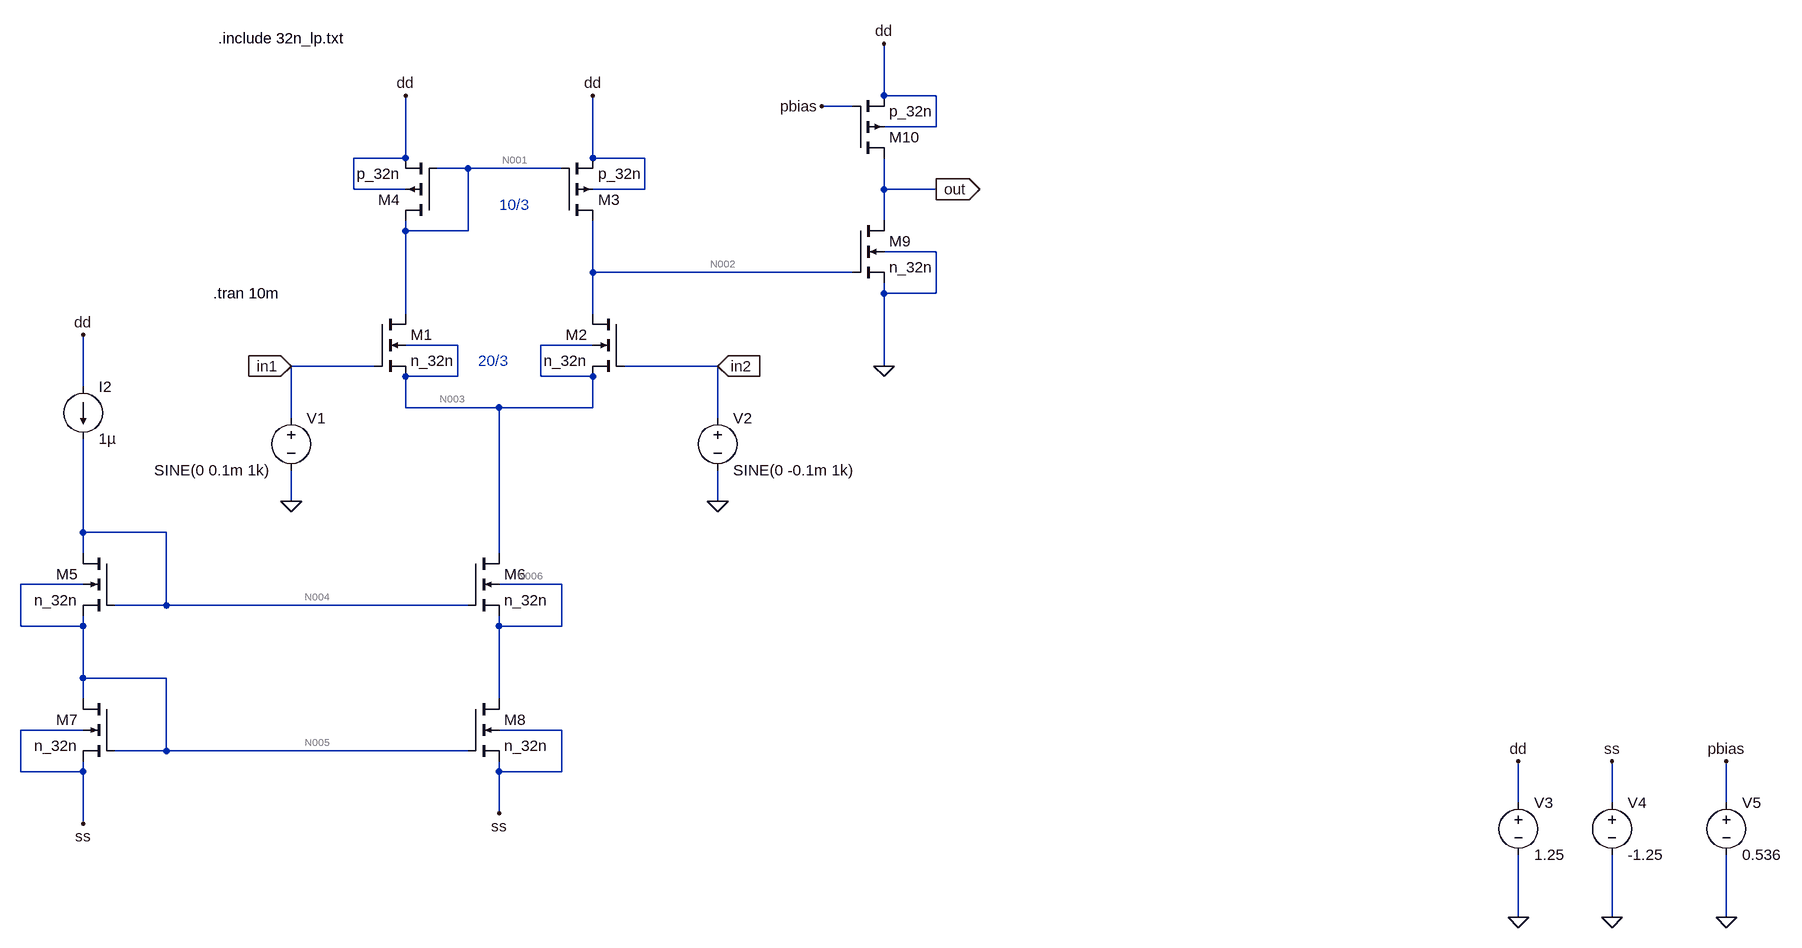
[diagram p0: schematic 32nm_ota.asc]
32nm_ota.asc, the LTspice schematic file:
Version 4
SHEET 1 3220 1188
WIRE 512 -96 512 -176
WIRE 592 -96 512 -96
WIRE 464 -80 416 -80
WIRE 592 -48 592 -96
WIRE 592 -48 512 -48
WIRE -224 0 -224 -96
WIRE -224 0 -304 0
WIRE 64 0 64 -96
WIRE 144 0 64 0
WIRE -128 16 -176 16
WIRE 16 16 -128 16
WIRE -304 48 -304 0
WIRE -224 48 -304 48
WIRE 144 48 144 0
WIRE 144 48 64 48
WIRE 512 48 512 0
WIRE 592 48 512 48
WIRE 512 96 512 48
WIRE -224 112 -224 96
WIRE -128 112 -128 16
WIRE -128 112 -224 112
WIRE 592 144 512 144
WIRE 64 176 64 96
WIRE 464 176 64 176
WIRE 512 208 512 192
WIRE 592 208 592 144
WIRE 592 208 512 208
WIRE -224 240 -224 112
WIRE 64 240 64 176
WIRE -144 288 -224 288
WIRE 64 288 -16 288
WIRE -272 320 -400 320
WIRE 256 320 112 320
WIRE 512 320 512 208
WIRE -144 336 -144 288
WIRE -144 336 -224 336
WIRE -16 336 -16 288
WIRE 64 336 -16 336
WIRE -720 352 -720 272
WIRE -224 384 -224 336
WIRE -80 384 -224 384
WIRE 64 384 64 336
WIRE 64 384 -80 384
WIRE -400 400 -400 320
WIRE 256 400 256 320
WIRE -400 528 -400 480
WIRE 256 528 256 480
WIRE -720 576 -720 432
WIRE -592 576 -720 576
WIRE -720 608 -720 576
WIRE -80 608 -80 384
WIRE -720 656 -816 656
WIRE 16 656 -80 656
WIRE -592 688 -592 576
WIRE -592 688 -672 688
WIRE -128 688 -592 688
WIRE -816 720 -816 656
WIRE -720 720 -720 704
WIRE -720 720 -816 720
WIRE -80 720 -80 704
WIRE 16 720 16 656
WIRE 16 720 -80 720
WIRE -720 800 -720 720
WIRE -592 800 -720 800
WIRE -720 832 -720 800
WIRE -80 832 -80 720
WIRE -720 880 -816 880
WIRE 16 880 -80 880
WIRE -592 912 -592 800
WIRE -592 912 -672 912
WIRE -128 912 -592 912
WIRE -816 944 -816 880
WIRE -720 944 -720 928
WIRE -720 944 -816 944
WIRE -80 944 -80 928
WIRE 16 944 16 880
WIRE 16 944 -80 944
WIRE 1488 992 1488 928
WIRE 1632 992 1632 928
WIRE 1808 992 1808 928
WIRE -80 1008 -80 944
WIRE -720 1024 -720 944
WIRE 1488 1168 1488 1072
WIRE 1632 1168 1632 1072
WIRE 1808 1168 1808 1072
FLAG 256 528 0
FLAG -400 528 0
FLAG 64 -96 dd
FLAG -224 -96 dd
FLAG 1488 1168 0
FLAG 1488 928 dd
FLAG 592 48 out
IOPIN 592 48 Out
FLAG -400 320 in1
IOPIN -400 320 In
FLAG 256 320 in2
IOPIN 256 320 In
FLAG -720 272 dd
FLAG 1632 1168 0
FLAG 1632 928 ss
FLAG -720 1024 ss
FLAG -80 1008 ss
FLAG 512 320 0
FLAG 512 -176 dd
FLAG 1808 1168 0
FLAG 1808 928 pbias
FLAG 416 -80 pbias
SYMBOL nmos4 -272 240 R0
SYMATTR InstName M1
SYMATTR Value n_32n
SYMATTR Value2 l=96n w=1.8u
SYMBOL nmos4 112 240 M0
SYMATTR InstName M2
SYMATTR Value n_32n
SYMATTR Value2 l=96n w=1.8u
SYMBOL voltage -400 384 R0
WINDOW 3 -211 96 Left 2
WINDOW 123 0 0 Left 0
WINDOW 39 0 0 Left 0
SYMATTR Value SINE(0 0.1m 1k)
SYMATTR InstName V1
SYMBOL voltage 256 384 R0
WINDOW 123 0 0 Left 0
WINDOW 39 0 0 Left 0
SYMATTR InstName V2
SYMATTR Value SINE(0 -0.1m 1k)
SYMBOL voltage 1488 976 R0
WINDOW 123 0 0 Left 0
WINDOW 39 0 0 Left 0
SYMATTR InstName V3
SYMATTR Value 1.25
SYMBOL pmos4 16 96 M180
SYMATTR InstName M3
SYMATTR Value p_32n
SYMATTR Value2 l=96n w=1u
SYMBOL pmos4 -176 96 R180
SYMATTR InstName M4
SYMATTR Value p_32n
SYMATTR Value2 l=96n w=1u
SYMBOL nmos4 -672 608 M0
SYMATTR InstName M5
SYMATTR Value n_32n
SYMATTR Value2 l=640n w=32n
SYMBOL nmos4 -128 608 R0
SYMATTR InstName M6
SYMATTR Value n_32n
SYMATTR Value2 l=640n w=32n
SYMBOL current -720 352 R0
WINDOW 123 0 0 Left 0
WINDOW 39 0 0 Left 0
SYMATTR InstName I2
SYMATTR Value 1µ
SYMBOL voltage 1632 976 R0
WINDOW 123 0 0 Left 0
WINDOW 39 0 0 Left 0
SYMATTR InstName V4
SYMATTR Value -1.25
SYMBOL nmos4 -672 832 M0
SYMATTR InstName M7
SYMATTR Value n_32n
SYMATTR Value2 l=640n w=32n
SYMBOL nmos4 -128 832 R0
SYMATTR InstName M8
SYMATTR Value n_32n
SYMATTR Value2 l=640n w=32n
SYMBOL nmos4 464 96 R0
SYMATTR InstName M9
SYMATTR Value n_32n
SYMATTR Value2 l=96n w=3.84u
SYMBOL pmos4 464 0 M180
SYMATTR InstName M10
SYMATTR Value p_32n
SYMATTR Value2 l=128n w=10.4u
SYMBOL voltage 1808 976 R0
WINDOW 123 0 0 Left 0
WINDOW 39 0 0 Left 0
SYMATTR InstName V5
SYMATTR Value 0.536
TEXT -512 -184 Left 2 !.include 32n_lp.txt
TEXT -520 208 Left 2 !.tran 10m
TEXT -112 312 Left 2 ;20/3
TEXT -80 72 Left 2 ;10/3

The netlist it stands for:
* 32nm_ota.asc
M1 N001 in1 N003 N003 n_32n l=96n w=1.8u
M2 N002 in2 N003 N003 n_32n l=96n w=1.8u
V1 in1 0 SINE(0 0.1m 1k)
V2 in2 0 SINE(0 -0.1m 1k)
V3 dd 0 1.25
M3 N002 N001 dd dd p_32n l=96n w=1u
M4 N001 N001 dd dd p_32n l=96n w=1u
M5 N004 N004 N005 N005 n_32n l=640n w=32n
M6 N003 N004 N006 N006 n_32n l=640n w=32n
I2 dd N004 1µ
V4 ss 0 -1.25
M7 N005 N005 ss ss n_32n l=640n w=32n
M8 N006 N005 ss ss n_32n l=640n w=32n
M9 out N002 0 0 n_32n l=96n w=3.84u
M10 out pbias dd dd p_32n l=128n w=10.4u
V5 pbias 0 0.536
.model NMOS NMOS
.model PMOS PMOS
.lib standard.mos
.include 32n_lp.txt
.tran 10m
* 20/3
* 10/3
.backanno
.end

* Results of the author's LTspice run, read from the files saved beside the schematic
* Operating Point, zero values left out:
*   V(n001) = 714.2 mV
*   V(n003) = -475.3 mV
*   V(n002) = 713.4 mV
*   V(dd) = 1.25 V
*   V(n004) = 884.3 mV
*   V(n005) = -182.9 mV
*   V(n006) = -624.7 mV
*   V(ss) = -1.25 V
*   V(out) = 605.8 mV
*   V(pbias) = 536 mV
*   Id(M10) = -92.61 µA
*   Ig(M10) = -551.5 pA
*   Is(M10) = 92.61 µA
*   Id(M4) = -494.1 nA
*   Is(M4) = 494.1 nA
*   Id(M3) = -494.2 nA
*   Is(M3) = 494.2 nA
*   Id(M9) = 92.61 µA
*   Ig(M9) = 247.5 pA
*   Is(M9) = -92.61 µA
*   Id(M8) = 991.1 nA
*   Ig(M8) = 197.8 pA
*   Is(M8) = -991.3 nA
*   Id(M7) = 996.6 nA
*   Ig(M7) = 196.9 pA
*   Ib(M7) = -1.279 pA
*   Is(M7) = -996.8 nA
*   Id(M6) = 988.1 nA
*   Ig(M6) = 3.023 nA
*   Ib(M6) = -377.8 pA
*   Is(M6) = -990.7 nA
*   Id(M5) = 996.8 nA
*   Ig(M5) = 197 pA
*   Ib(M5) = -1.279 pA
*   Is(M5) = -997 nA
*   Id(M2) = 494 nA
*   Ib(M2) = -2.923 pA
*   Is(M2) = -494 nA
*   Id(M1) = 494.1 nA
*   Ib(M1) = -2.959 pA
*   Is(M1) = -494.1 nA
*   I(I2) = 1 µA
*   I(V5) = 551.5 pA
*   I(V4) = 1.988 µA
*   I(V3) = -94.59 µA
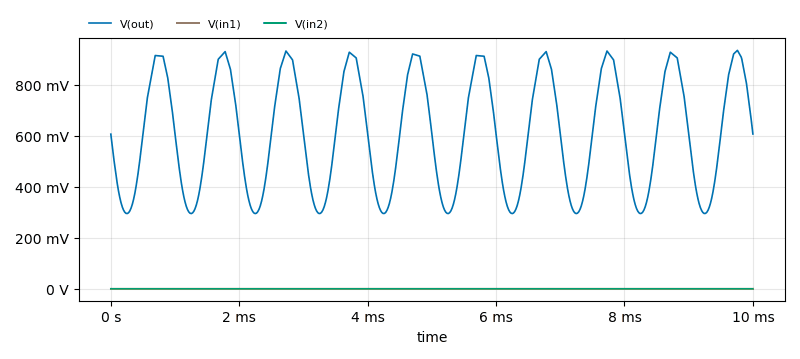
[diagram p1: Transient Analysis of 32nm_ota.asc, plotted from the saved traces]
* Transient Analysis, 1 run:
*   V(out): min 294.6 mV, max 934.1 mV, average 606.7 mV, rms 648.6 mV, last 606.4 mV
*   V(in1): min -99.83 µV, max 100 µV, average 918.8 nV, rms 70.42 µV, last 0 V
*   V(in2): min -100 µV, max 99.83 µV, average -918.8 nV, rms 70.42 µV, last 0 V